# Altium schematic sheet Sheet1.SchDoc
size A; SheetNumber: 1; SheetTotal: 1
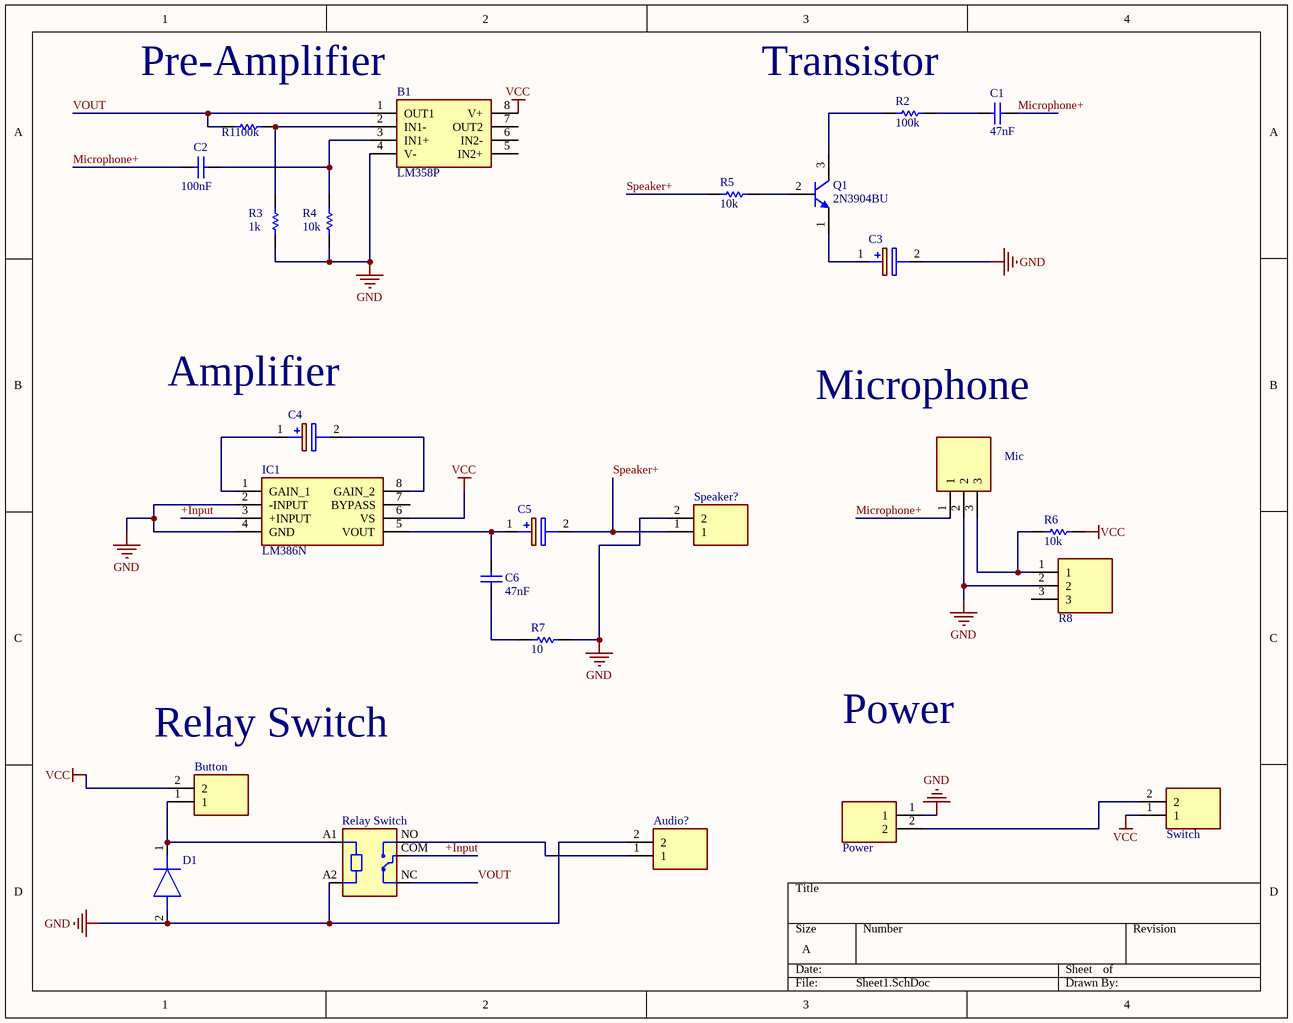
[diagram p0: Sheet1.SchDoc]

## Parts
Audio?  B2B-PH-K-S__LF__SN_  [B2BPHKSLFSN]  (value not drawn)
B1  LM358P  [DIP794W53P254L959H508Q8N]
Button  B2B-PH-K-S__LF__SN_  [B2BPHKSLFSN]  (value not drawn)
C1  Capacitance: 47nF  [KEMT-C330C105M5U5TA]  (hidden comment: C330C105M5U5TA)
C2  Capacitance: 100nF  [KEMT-C330C105M5U5TA]  (hidden comment: C330C105M5U5TA)
C3  SD1E106M05011BB  [CAPPRD200W55D525H1250]  (value not drawn)
C4  SD1E106M05011BB  [CAPPRD200W55D525H1250]  (value not drawn)
C5  SD1E106M05011BB  [CAPPRD200W55D525H1250]  (value not drawn)
C6  Capacitance: 47nF  [KEMT-C330C105M5U5TA]  (hidden comment: C330C105M5U5TA)
D1  1N4149TR  [DIOAD1068W53L380D172]  (value not drawn)
IC1  LM386N  [DIP794W53P254L959H508Q8N]
Mic  B3B-XH-A_LF__SN_  [B3BXHALFSN]  (value not drawn)
Power  B2B-PH-K-S__LF__SN_  [B2BPHKSLFSN]  (value not drawn)
Q1  2N3904BU  [FAIR-TO-92]
R1  Resistance: 100k  [RESA60-630X240]  (hidden comment: MFR-25FBF52-1K)
R2  Resistance: 100k  [RESA60-630X240]  (hidden comment: MFR-25FBF52-1K)
R3  Resistance: 1k  [RESA60-630X240]  (hidden comment: MFR-25FBF52-1K)
R4  Resistance: 10k  [RESA60-630X240]  (hidden comment: MFR-25FBF52-1K)
R5  Resistance: 10k  [RESA60-630X240]  (hidden comment: MFR-25FBF52-1K)
R6  Resistance: 10k  [RESA60-630X240]  (hidden comment: MFR-25FBF52-1K)
R7  Resistance: 10  [RESA60-630X240]  (hidden comment: MFR-25FBF52-1K)
R8  B3B-XH-A_LF__SN_  [B3BXHALFSN]  (value not drawn)
Relay_Switch  SRD-05VDC-SL-C  [RELAY_SRD-05VDC-SL-C]  (value not drawn)
Speaker?  B2B-PH-K-S__LF__SN_  [B2BPHKSLFSN]  (value not drawn)
Switch  B2B-PH-K-S__LF__SN_  [B2BPHKSLFSN]  (value not drawn)

## Nets
GND: Audio?.2 B1.4(V-) C3.2(-) D1.2(A) IC1.2(-INPUT) IC1.4(GND) Mic.2 Power.1 R3.1 R4.1 R7.1 R8.2 Relay_Switch.A2 Speaker?.2
VCC: B1.8(V+) Button.2 IC1.6(VS) R6.1 Switch.1
+Input: IC1.3(+INPUT) Relay_Switch.COM
Microphone+: C1.1 C2.2 Mic.1
Speaker+: C5.2(-) R5.2 Speaker?.1
VOUT: B1.1(OUT1) R1.1 Relay_Switch.NC
NetAudio?_1: Audio?.1 Relay_Switch.NO
NetB1_2: B1.2(IN1-) R1.2 R3.2
NetB1_3: B1.3(IN1+) C2.1 R4.2
NetButton_1: Button.1 D1.1(K) Relay_Switch.A1
NetC1_2: C1.2 R2.1
NetC3_1: C3.1(+) Q1.1(E)
NetC4_1: C4.1(+) IC1.1(GAIN_1)
NetC4_2: C4.2(-) IC1.8(GAIN_2)
NetC5_1: C5.1(+) C6.2 IC1.5(VOUT)
NetC6_1: C6.1 R7.2
NetMic_3: Mic.3 R6.2 R8.1
NetPower_2: Power.2 Switch.2
NetQ1_2: Q1.2(B) R5.1
NetQ1_3: Q1.3(C) R2.2

Not connected (* = marked no-connect by the designer): B1 5(IN2+) 6(IN2-) 7(OUT2); IC1 7(BYPASS); R8 3

## Notes on the sheet
- Pre-Amplifier
- Transistor
- (near C4) Amplifier
- Microphone
- (near Button) Relay Switch
- Power

## Library data of the parts
Audio? Button Power Speaker? Switch = B2B-PH-K-S__LF__SN_: Circulator or Directional Coupler; Manufacturer_Name: JST (JAPAN SOLDERLESS TERMINALS); Manufacturer_Part_Number: B2B-PH-K-S (LF)(SN); Datasheet Link: http://www.jst-mfg.com/product/pdf/eng/ePH.pdf; Height: 6mm
B1 = LM358P: LM358P, Dual Operational Amplifier 0.7MHz 5 to 28V, 8-Pin PDIP; Manufacturer_Name: Texas Instruments; Geometry.Height: 5.08mm; Mouser Part Number: 595-LM358P; Mouser Price/Stock: https://www.mouser.co.uk/ProductDetail/Texas-Instruments/LM358P?qs=X1HXWTtiZ0QtOTT8%252BVnsyw%3D%3D; Manufacturer_Part_Number: LM358P; Datasheet Link: http://www.ti.com/lit/ds/symlink/lm358a.pdf
C1 C2 C6 = CMP-2000-06056-1: Ceramic Capacitor, 1 uF, +/- 20%, 50 V, -10 to 85 degC, 2-Pin THD, RoHS, Bulk; Manufacturer: Kemet; Voltage - Rated: 50V; Temperature Coefficient: Z5U; Catalog Drawings: C330(std); Product Training Modules: CapacitorBasics-TypicalUsesforCapacitors; Online Catalog: GoldenMax™Series; Other Names: 399-4390; PCN Design/Specification: C3yySeriesGoldenMaxLeadConfiguration02/Feb/2015; Thickness (Max): -; Size / Dimension: 0.300"Lx0.150"W(7.62mmx3.81mm); Mounting Technology: ThroughHole; Tolerance: ±20%; Mounting Type: ThroughHole; Datasheet URL: http://www.kemet.com/Lists/ProductCatalog/Attachments/599/KEM_C1051_GOLDMAX_Z5U.pdf; Series: GoldenMax™; Standard Package: 250; Ratings: -; Applications: GeneralPurpose; Package Reference: C330C105M5U5TA; Packaging: Bulk; Category: Capacitors; Package Description: 2-Pin Through Hole Device, Body 7.11 x 4.07 mm; Operating Temperature: 10°C~85°C; Height - Seated (Max): 0.360"(9.14mm); Manufacturer URL: http://www.kemet.com/; Lead Spacing: 0.200"(5.08mm); Features: -; Lead Style: Straight; Package / Case: Radial; Family: CeramicCapacitors; Datasheet Version: 12/2015
C3-C5 = SD1E106M05011BB: Capacitor Polarised; Manufacturer_Name: SAMWHA; Datasheet Link: https://www.tme.eu/Document/d3dd2092f3e0a8bc90045cfef03351bc/SD.pdf; Height: 12.5mm; Manufacturer_Part_Number: SD1E106M05011BB
D1 = 1N4149TR: Diode; Manufacturer_Name: onsemi; Datasheet Link: https://www.onsemi.com/pub/Collateral/1N4149-D.PDF; Manufacturer_Part_Number: 1N4149TR; Mouser Part Number: 512-1N4149TR; Mouser Price/Stock: https://www.mouser.co.uk/ProductDetail/onsemi-Fairchild/1N4149TR?qs=VZOZQ19d7%2FIpYVTk5v1ckw%3D%3D; Arrow Part Number: 1N4149TR; Arrow Price/Stock: https://www.arrow.com/en/products/1n4149tr/on-semiconductor?utm_currency=USD&region=nac
IC1 = LM386N: Integrated Circuit; Manufacturer_Name: Texas Instruments; Datasheet Link: http://www.ti.com/lit/ds/symlink/lm386.pdf; Height: 5.08mm; Manufacturer_Part_Number: LM386N; Mouser Part Number: 595-LM386N; Mouser Price/Stock: https://www.mouser.co.uk/ProductDetail/Texas-Instruments/LM386N?qs=E2%2FxqS9xjzoJP%2FIW26Y6YA%3D%3D
Mic R8 = B3B-XH-A_LF__SN_: Connector; Manufacturer_Name: JST (JAPAN SOLDERLESS TERMINALS); Manufacturer_Part_Number: B3B-XH-A(LF)(SN); Datasheet Link: https://datasheet.lcsc.com/szlcsc/1812131720_JST-Sales-America-B3B-XH-A-LF-SN_C144394.pdf; Height: 7mm; Mouser Part Number: 306-B3BXHALFSNP; Mouser Price/Stock: https://www.mouser.co.uk/ProductDetail/JST-Commercial/B3B-XH-ALFSN?qs=cdbOS8ANM9BVkoboCCIEMQ%3D%3D; Arrow Part Number: B3B-XH-A(LF)(SN); Arrow Price/Stock: https://www.arrow.com/en/products/b3b-xh-a-lf-sn/jst-manufacturing?utm_currency=USD&region=europe
Q1 = CMP-2000-04944-1: NPN General-Purpose Amplifier, 40 V VCEO, 0.2 A, -55 to 150 degC, 2-Pin TO-92, RoHS, Bulk; Manufacturer: FairchildSemiconductor; Maximum Collector Base Voltage: 60V; Minimum DC Current Gain: 40@0.1mA@1V|70@1mA@1V|100@10mA@1V|60@50mA@1V|30@100mA@1V; Maximum Collector Emitter Voltage: 40V; Maximum DC Collector Current: 0.2A; Rad Hard: No; Maximum Operating Frequency: 300(Min)MHz; Maximum Collector Emitter Saturation Voltage: 0.2@1mA@10mA|0.3@5mA@50mAV; Maximum Power Dissipation: 625mW; Package Description: 3-Pin Transistor Outline Package, Body Dia 4.79 mm, Pitch 1.27 mm; Package Reference: TO-92; Pin Count: 3; Operating Temperature: -55to150degC; Category: GPBJT; Manufacturer URL: https://www.fairchildsemi.com/; Datasheet URL: https://datasheet.ciiva.com/4722/2n3904-82270-4722369.pdf; Package: 3TO-92; Packaging: Bulk; Type: NPN; Datasheet Version: Rev. 1.1.0, 10/2014; Mounting: ThroughHole
R1-R7 = CMP-1659-00075-1: Axial Resistor, 1 KOhm, +/- 1%, 250 mW, -55 to 155 degC, 2-Pin THD, RoHS, Bulk; Voltage Rating: 250 V; Power Rating: 250 mW; ComponentLink2Description: Datasheet; RoHSCompliant: true; PackageReference: MFR-25; Case\Package: Axial; Max Operating Temperature: 155 degC; DatasheetVersion: Apr-13; Tolerance: 1%; ComponentLink1URL: http://www.yageo.com/; Length: 0.248 inch; ComponentLink2URL: http://www.yageo.com/documents/recent/Yageo%20LR_MFR_2013.pdf; Packaging: Bulk; Package Quantity: 200; PackageDescription: 2-Pin Axial Lead, Dia 2.4 mm, Body Length 6.3 mm; Min Operating Temperature: -55 degC; ComponentLink1Description: Manufacturer URL
Relay_Switch = SRD-05VDC-SL-C: 5V Trigger Relay Module For Arduino And Raspberry Pi 5V Trigger Relay Module For Arduino And Raspberry Pi; MF: Songle Relay; Check_prices: https://www.snapeda.com/parts/SRD-05VDC-SL-C/Songle+Relay/view-part/?ref=eda; Value: *; Availability: Not in stock; Price: None; Package: NON STANDARD-5 Songle Relay; MP: SRD-05VDC-SL-C; SnapEDA_Link: https://www.snapeda.com/parts/SRD-05VDC-SL-C/Songle+Relay/view-part/?ref=snap